# Altium project cannonrobot.PrjPCB
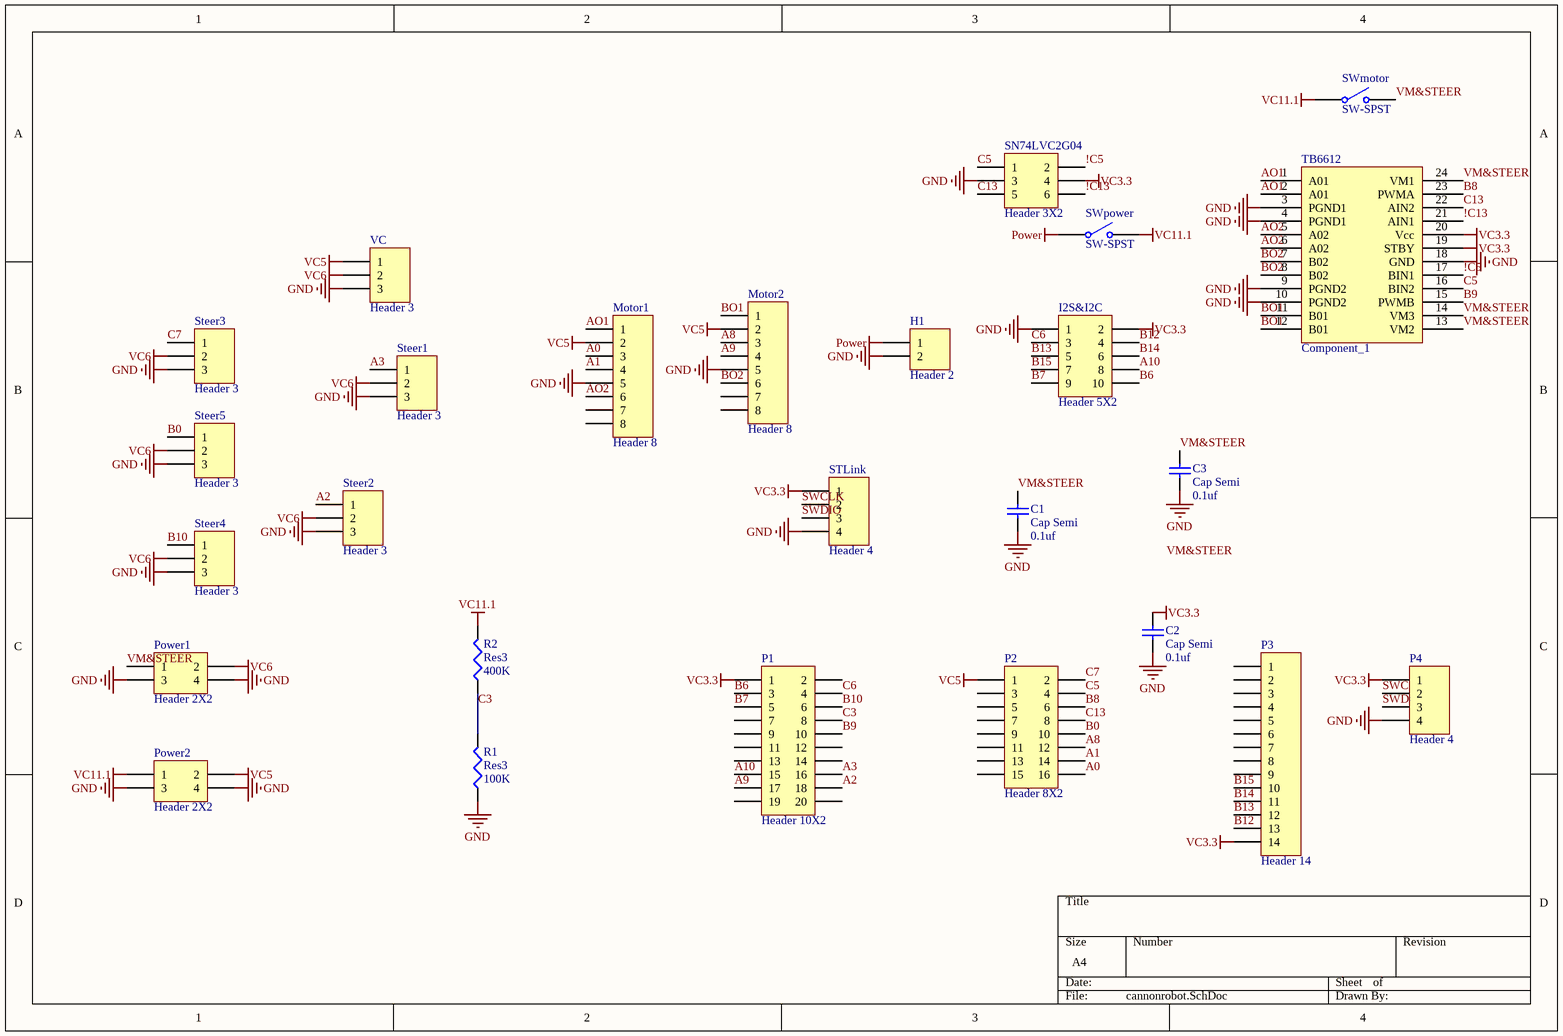
[diagram p0: cannonrobot.SchDoc]
1 sheet, 26 parts. Net scope: global (net labels, ports and power ports of the same name join across sheets).
Board file: cannonrobot.PcbDoc

## Sheet cannonrobot.SchDoc
size A4

### Parts
C1  Cap Semi  value 0.1uf  [CAPC3225L]
C2  Cap Semi  value 0.1uf  [CAPC2512L]
C3  Cap Semi  value 0.1uf  [CAPC2512L]
H1  Header 2  [PCBComponent_1]
I2S&I2C  Header 5X2  [HDR2X5]
Motor1  Header 8  [J_JAT_A1250WV-S-06P]
Motor2  Header 8  [J_JAT_A1250WV-S-06P]
P1  Header 10X2  [HDR2X10]
P2  Header 8X2  [HDR2X8]
P3  Header 14  [HDR1X14]
P4  Header 4  [HDR1X4]
Power1  Header 2X2  [PCBComponent_1]
Power2  Header 2X2  [PCBComponent_1]
R1  Res3  value 100K  [RESC1608L]
R2  Res3  value 400K  [RESC1608L]
SN74LVC2G04  Header 3X2  [PCBComponent_1]
Steer1  Header 3  [HDR1X3]
Steer2  Header 3  [HDR1X3]
Steer3  Header 3  [HDR1X3]
Steer4  Header 3  [HDR1X3]
Steer5  Header 3  [HDR1X3]
STLink  Header 4  [HDR1X4]
SWmotor  SW-SPST  [PCBComponent_1]
SWpower  SW-SPST  [PCBComponent_1]
TB6612  Component_1  [SSOP24 - duplicate]
VC  Header 3  [HDR1X3]

### Nets
GND: C1.1 C2.1 C3.1 H1.2 I2S&I2C.1 Motor1.5 Motor2.5 P4.4 Power1.3 Power1.4 Power2.3 Power2.4 R1.1 SN74LVC2G04.3 Steer1.3 Steer2.3 Steer3.3 Steer4.3 Steer5.3 STLink.4 TB6612.3(PGND1) TB6612.4(PGND1) TB6612.9(PGND2) TB6612.10(PGND2) TB6612.18(GND) VC.3
Power: H1.1 SWpower.1(COMMON)
VC3.3: C2.2 I2S&I2C.2 P1.1 P3.14 P4.1 SN74LVC2G04.4 STLink.1 TB6612.19(STBY) TB6612.20(Vcc)
VC5: Motor1.2 Motor2.2 P2.1 Power2.2 VC.1
VC6: Power1.2 Steer1.2 Steer2.2 Steer3.2 Steer4.2 Steer5.2 VC.2
VC11.1: Power2.1 R2.2 SWmotor.1(COMMON) SWpower.2(NO)
!C5: SN74LVC2G04.2 TB6612.17(BIN1)
!C13: SN74LVC2G04.6 TB6612.21(AIN1)
A0: Motor1.3 P2.16
A1: Motor1.4 P2.14
A2: P1.18 Steer2.1
A3: P1.16 Steer1.1
A8: Motor2.3 P2.12
A9: Motor2.4 P1.17
A10: I2S&I2C.8 P1.15
AO1: Motor1.1 TB6612.1(A01) TB6612.2(A01)
AO2: Motor1.6 TB6612.5(A02) TB6612.6(A02)
B0: P2.10 Steer5.1
B6: I2S&I2C.10 P1.3
B7: I2S&I2C.9 P1.5
B8: P2.6 TB6612.23(PWMA)
B9: P1.10 TB6612.15(PWMB)
B10: P1.6 Steer4.1
B12: I2S&I2C.4 P3.13
B13: I2S&I2C.5 P3.12
B14: I2S&I2C.6 P3.11
B15: I2S&I2C.7 P3.10
BO1: Motor2.1 TB6612.11(B01) TB6612.12(B01)
BO2: Motor2.6 TB6612.7(B02) TB6612.8(B02)
C3: P1.8 R1.2 R2.1
C5: P2.4 SN74LVC2G04.1 TB6612.16(BIN2)
C6: I2S&I2C.3 P1.4
C7: P2.2 Steer3.1
C13: P2.8 SN74LVC2G04.5 TB6612.22(AIN2)
SWCLK: P4.2 STLink.2
SWDIO: P4.3 STLink.3
VM&STEER: C1.2 C3.2 Power1.1 SWmotor.2(NO) TB6612.13(VM2) TB6612.14(VM3) TB6612.24(VM1)

Not connected (* = marked no-connect by the designer): Motor1 7 8; Motor2 7 8; P1 2 7 9 11 12 13 14 19 20; P2 3 5 7 9 11 13 15; P3 1 2 3 4 5 6 7 8 9

### Notes on the sheet
- Labels drawn without touching a wire or pin: VM&STEER

### Library data of the parts
C1-C3 = Cap Semi: Capacitor (Semiconductor SIM Model); Published: 8-Jun-2000; LatestRevisionDate: 29-May-2009; LatestRevisionNote: IPC-7351 Footprint Added.; PackageReference: C1206; Publisher: Altium Limited; PackageDescription: Chip Capacitor
H1 = Header 2: Header, 2-Pin; LatestRevisionDate: 17-Jul-2002; LatestRevisionNote: Re-released for DXP Platform.; Publisher: Altium Limited
I2S&I2C = Header 5X2: Header, 5-Pin, Dual row; LatestRevisionDate: 17-Jul-2002; LatestRevisionNote: Re-released for DXP Platform.; Publisher: Altium Limited
Motor1 Motor2 = Header 8: Header, 8-Pin; LatestRevisionDate: 17-Jul-2002; LatestRevisionNote: Re-released for DXP Platform.; Publisher: Altium Limited
P1 = Header 10X2: Header, 10-Pin, Dual row; LatestRevisionDate: 17-Jul-2002; LatestRevisionNote: Re-released for DXP Platform.; Publisher: Altium Limited
P2 = Header 8X2: Header, 8-Pin, Dual row; LatestRevisionDate: 17-Jul-2002; LatestRevisionNote: Re-released for DXP Platform.; Publisher: Altium Limited
P3 = Header 14: Header, 14-Pin; LatestRevisionDate: 17-Jul-2002; LatestRevisionNote: Re-released for DXP Platform.; Publisher: Altium Limited
P4 STLink = Header 4: Header, 4-Pin; LatestRevisionDate: 17-Jul-2002; LatestRevisionNote: Re-released for DXP Platform.; Publisher: Altium Limited
Power1 Power2 = Header 2X2: Header, 2-Pin, Dual row; LatestRevisionDate: 17-Jul-2002; LatestRevisionNote: Re-released for DXP Platform.; Publisher: Altium Limited
R1 R2 = Res3: Resistor; Published: 8-Jun-2000; LatestRevisionDate: 29-May-2009; LatestRevisionNote: IPC-7351 Footprint Added.; PackageReference: J1-0603; Publisher: Altium Limited; PackageDescription: Chip Resistor
SN74LVC2G04 = Header 3X2: Header, 3-Pin, Dual row; LatestRevisionDate: 17-Jul-2002; LatestRevisionNote: Re-released for DXP Platform.; Publisher: Altium Limited
Steer1-Steer5 VC = Header 3: Header, 3-Pin; LatestRevisionDate: 17-Jul-2002; LatestRevisionNote: Re-released for DXP Platform.; Publisher: Altium Limited
SWmotor SWpower = SW-SPST: Single-Pole, Single-Throw Switch; Published: 24-Mar-1999; LatestRevisionDate: 17-Jul-2002; LatestRevisionNote: Re-released for DXP Platform.; PackageReference: SPST-2; Publisher: Altium Limited